# EAGLE design hd-gs (EAGLE 9.6.2)
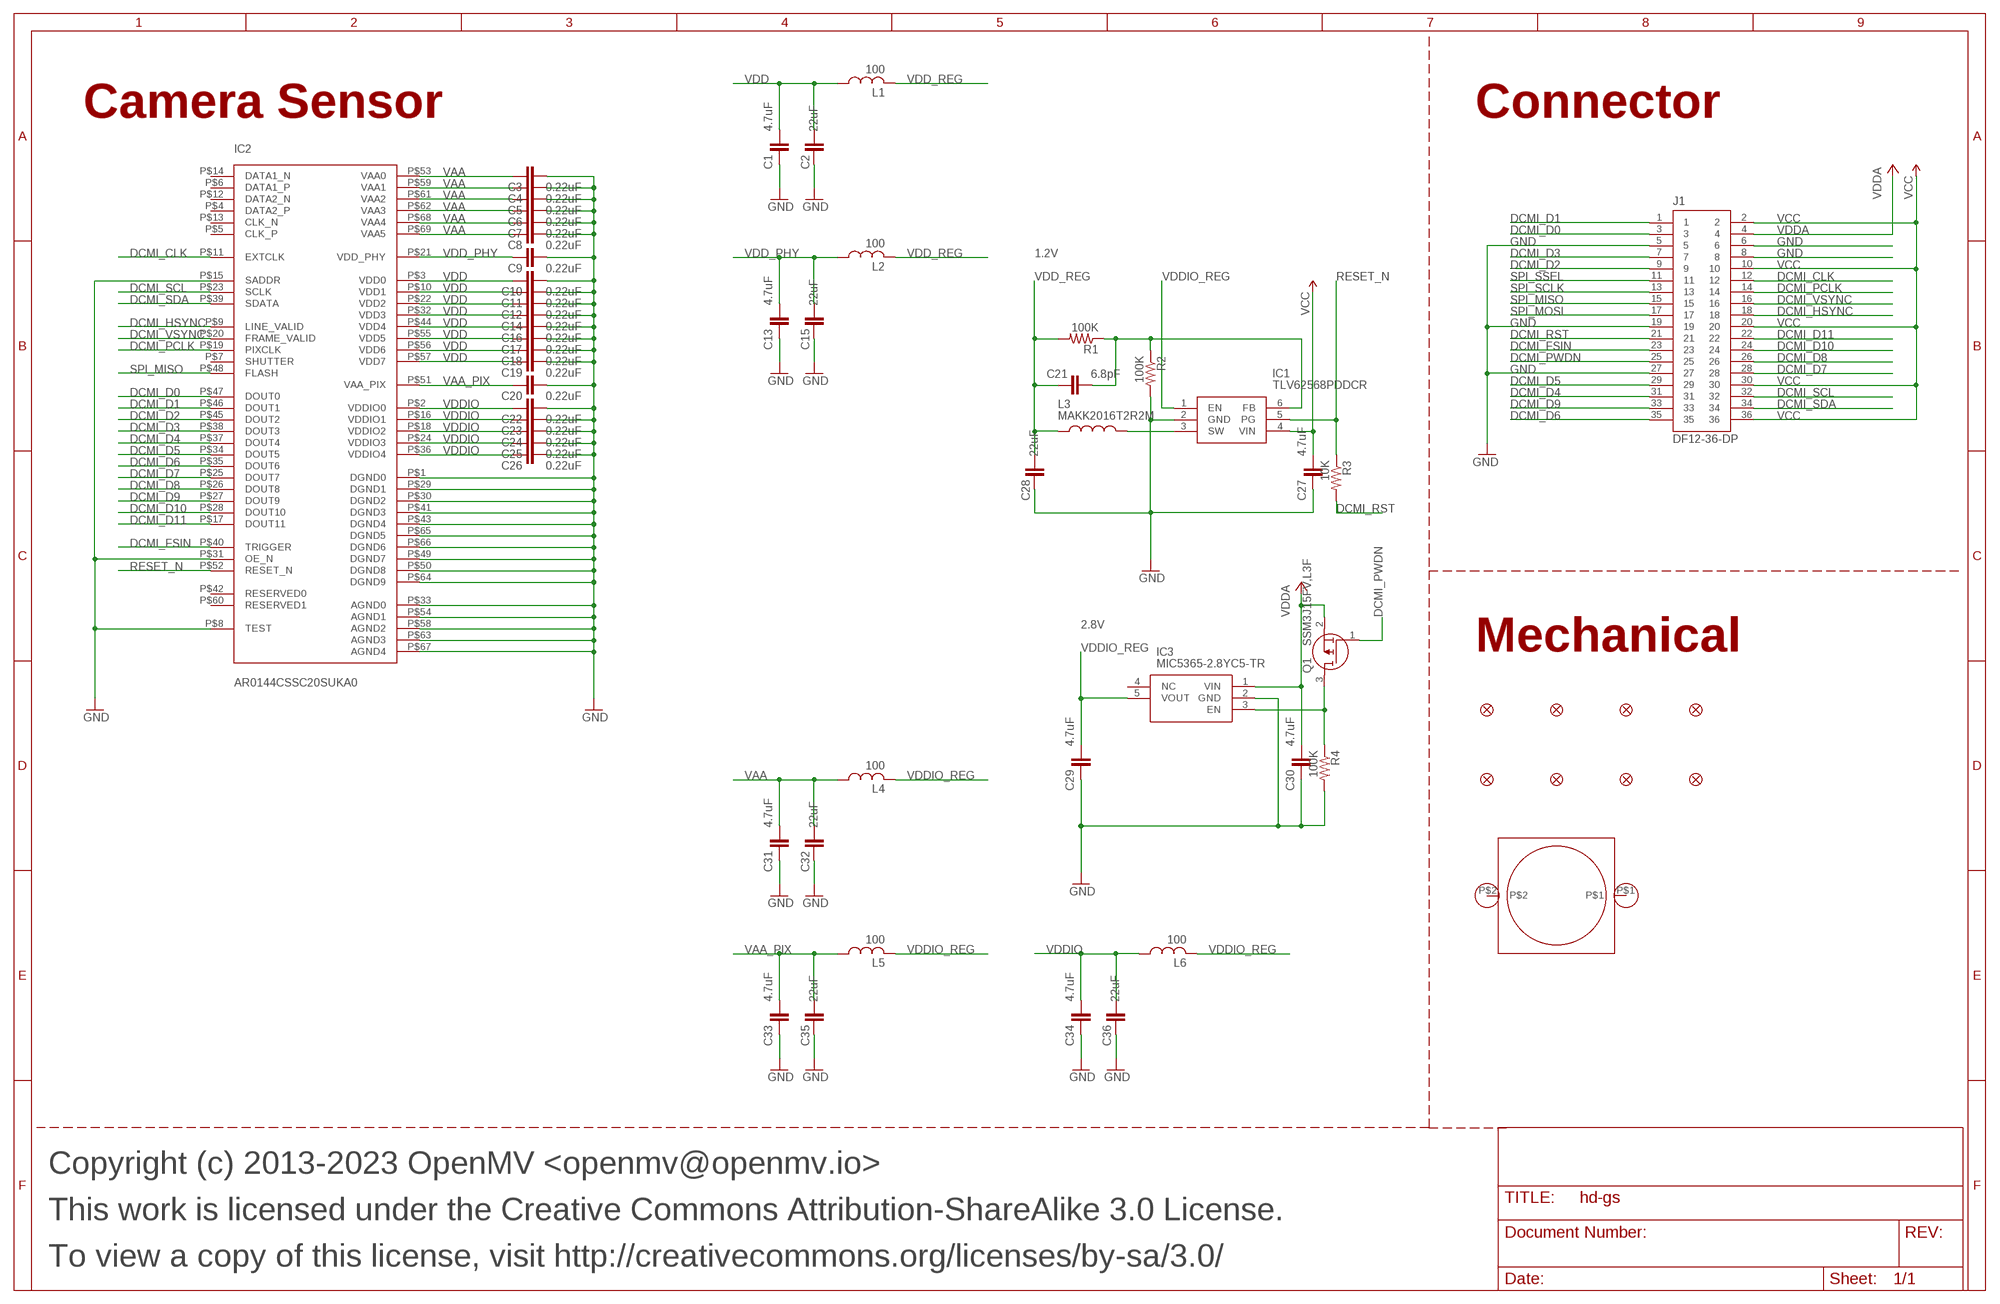
[diagram p0: schematic, sheet 1]

## Parts
C1  4.7uF  CAP_0402  [0402]
C2  22uF  22UF-0805-6.3V-20%  [0805]
C3  0.22uF  C-EUC0201  [C0201]
C4  0.22uF  C-EUC0201  [C0201]
C5  0.22uF  C-EUC0201  [C0201]
C6  0.22uF  C-EUC0201  [C0201]
C7  0.22uF  C-EUC0201  [C0201]
C8  0.22uF  C-EUC0201  [C0201]
C9  0.22uF  C-EUC0201  [C0201]
C10  0.22uF  C-EUC0201  [C0201]
C11  0.22uF  C-EUC0201  [C0201]
C12  0.22uF  C-EUC0201  [C0201]
C13  4.7uF  CAP_0402  [0402]
C14  0.22uF  C-EUC0201  [C0201]
C15  22uF  22UF-0805-6.3V-20%  [0805]
C16  0.22uF  C-EUC0201  [C0201]
C17  0.22uF  C-EUC0201  [C0201]
C18  0.22uF  C-EUC0201  [C0201]
C19  0.22uF  C-EUC0201  [C0201]
C20  0.22uF  C-EUC0201  [C0201]
C21  6.8pF  CAP_0402  [0402]
C22  0.22uF  C-EUC0201  [C0201]
C23  0.22uF  C-EUC0201  [C0201]
C24  0.22uF  C-EUC0201  [C0201]
C25  0.22uF  C-EUC0201  [C0201]
C26  0.22uF  C-EUC0201  [C0201]
C27  4.7uF  CAP_0402  [0402]
C28  22uF  22UF-0805-6.3V-20%  [0805]
C29  4.7uF  CAP_0402  [0402]
C30  4.7uF  CAP_0402  [0402]
C31  4.7uF  CAP_0402  [0402]
C32  22uF  22UF-0805-6.3V-20%  [0805]
C33  4.7uF  CAP_0402  [0402]
C34  4.7uF  CAP_0402  [0402]
C35  22uF  22UF-0805-6.3V-20%  [0805]
C36  22uF  22UF-0805-6.3V-20%  [0805]
FD1  FIDUCIAL1X2  [FIDUCIAL-1X2]
FD2  FIDUCIAL1X2  [FIDUCIAL-1X2]
FD3  FIDUCIAL1X2  [FIDUCIAL-1X2]
FD4  FIDUCIAL1X2  [FIDUCIAL-1X2]
FD5  FIDUCIAL1X2  [FIDUCIAL-1X2]
FD6  FIDUCIAL1X2  [FIDUCIAL-1X2]
FD7  FIDUCIAL1X2  [FIDUCIAL-1X2]
FD8  FIDUCIAL1X2  [FIDUCIAL-1X2]
H1  LENSMOUNT20MM  [LENSMOUNT-20MM]
IC1  TLV62568PDDCR  [SOT95P280X110-6N]
IC2  AR0144CSSC20SUKA0  [AR0144CSSC20SUKA0]
IC3  MIC5365-2.8YC5-TR  [SOT65P210X110-5N]
J1  DF12-36-DP  [DF12-36-DP]
L1  100  INDUCTOR_0402  [0402]
L2  100  INDUCTOR_0402  [0402]
L3  MAKK2016T2R2M  [INDC2016X100N]
L4  100  INDUCTOR_0402  [0402]
L5  100  INDUCTOR_0402  [0402]
L6  100  INDUCTOR_0402  [0402]
Q1  SSM3J15FV,L3F  [SSM3J15FVL3F]
R1  100K  R-US_R0402  [R0402]
R2  100K  R-US_R0402  [R0402]
R3  10K  R-US_R0402  [R0402]
R4  100K  R-US_R0402  [R0402]

## Nets
DCMI_CLK [signal]: IC2.P$11(EXTCLK) J1.12
DCMI_D0 [signal]: IC2.P$47(DOUT0) J1.3
DCMI_D1 [signal]: IC2.P$46(DOUT1) J1.1
DCMI_D2 [signal]: IC2.P$45(DOUT2) J1.9
DCMI_D3 [signal]: IC2.P$38(DOUT3) J1.7
DCMI_D4 [signal]: IC2.P$37(DOUT4) J1.31
DCMI_D5 [signal]: IC2.P$34(DOUT5) J1.29
DCMI_D6 [signal]: IC2.P$35(DOUT6) J1.35
DCMI_D7 [signal]: IC2.P$25(DOUT7) J1.28
DCMI_D8 [signal]: IC2.P$26(DOUT8) J1.26
DCMI_D9 [signal]: IC2.P$27(DOUT9) J1.33
DCMI_D10 [signal]: IC2.P$28(DOUT10) J1.24
DCMI_D11 [signal]: IC2.P$17(DOUT11) J1.22
DCMI_FSIN [signal]: IC2.P$40(TRIGGER) J1.23
DCMI_HSYNC [signal]: IC2.P$9(LINE_VALID) J1.18
DCMI_PCLK [signal]: IC2.P$19(PIXCLK) J1.14
DCMI_PWDN [signal]: J1.25 Q1.1(G)
DCMI_PWDN_INT [signal]: IC3.3(EN) Q1.3(D) R4.1
DCMI_RST [signal]: J1.21 R3.2
DCMI_SCL [signal]: IC2.P$23(SCLK) J1.32
DCMI_SDA [signal]: IC2.P$39(SDATA) J1.34
DCMI_VSYNC [signal]: IC2.P$20(FRAME_VALID) J1.16
FB [pwr]: C21.2 IC1.6(FB) R1.1 R2.1
GND [gnd]: C1.1 C2.1 C3.2 C4.2 C5.2 C6.2 C7.2 C8.2 C9.2 C10.2 C11.2 C12.2 C13.1 C14.2 C15.1 C16.2 C17.2 C18.2 C19.2 C20.2 C22.2 C23.2 C24.2 C25.2 C26.2 C27.1 C28.1 C29.1 C30.1 C31.1 C32.1 C33.1 C34.1 C35.1 C36.1 IC1.2(GND) IC2.P$1(DGND0) IC2.P$8(TEST) IC2.P$15(SADDR) IC2.P$29(DGND1) IC2.P$30(DGND2) IC2.P$31(OE_N) IC2.P$33(AGND0) IC2.P$41(DGND3) IC2.P$43(DGND4) IC2.P$49(DGND7) IC2.P$50(DGND8) IC2.P$54(AGND1) IC2.P$58(AGND2) IC2.P$63(AGND3) IC2.P$64(DGND9) IC2.P$65(DGND5) IC2.P$66(DGND6) IC2.P$67(AGND4) IC3.2(GND) J1.5 J1.6 J1.8 J1.19 J1.27 R2.2 R4.2
RESET_N [signal]: IC1.5(PG) IC2.P$52(RESET_N) R3.1
SPI_MISO [signal]: IC2.P$48(FLASH) J1.15
SPI_MOSI [signal]: J1.17
SPI_SCLK [signal]: J1.13
SPI_SSEL [signal]: J1.11
SW [pwr]: IC1.3(SW) L3.2
VAA [pwr]: C3.1 C4.1 C5.1 C6.1 C7.1 C8.1 C31.2 C32.2 IC2.P$53(VAA0) IC2.P$59(VAA1) IC2.P$61(VAA2) IC2.P$62(VAA3) IC2.P$68(VAA4) IC2.P$69(VAA5) L4.1
VAA_PIX [pwr]: C20.1 C33.2 C35.2 IC2.P$51(VAA_PIX) L5.1
VCC [pwr]: C27.2 IC1.4(VIN) J1.2 J1.10 J1.20 J1.30 J1.36
VDD [pwr]: C1.2 C2.2 C10.1 C11.1 C12.1 C14.1 C16.1 C17.1 C18.1 C19.1 IC2.P$3(VDD0) IC2.P$10(VDD1) IC2.P$22(VDD2) IC2.P$32(VDD3) IC2.P$44(VDD4) IC2.P$55(VDD5) IC2.P$56(VDD6) IC2.P$57(VDD7) L1.1
VDD_PHY [pwr]: C9.1 C13.2 C15.2 IC2.P$21(VDD_PHY) L2.1
VDD_REG [pwr]: C21.1 C28.2 L1.2 L2.2 L3.1 R1.2
VDDA [pwr]: C30.2 IC3.1(VIN) J1.4 Q1.2(S)
VDDIO [pwr]: C22.1 C23.1 C24.1 C25.1 C26.1 C34.2 C36.2 IC2.P$2(VDDIO0) IC2.P$16(VDDIO1) IC2.P$18(VDDIO2) IC2.P$24(VDDIO3) IC2.P$36(VDDIO4) L6.1
VDDIO_REG [pwr]: C29.2 IC1.1(EN) IC3.5(VOUT) L4.2 L5.2 L6.2
Unconnected: H1.P$1 H1.P$2 IC2.P$4(DATA2_P) IC2.P$5(CLK_P) IC2.P$6(DATA1_P) IC2.P$7(SHUTTER) IC2.P$12(DATA2_N) IC2.P$13(CLK_N) IC2.P$14(DATA1_N) IC2.P$42(RESERVED0) IC2.P$60(RESERVED1) IC3.4(NC)

## Notes on the sheet
- Camera Sensor | Connector
- 1.2V
- 2.8V
- Mechanical
- Copyright (c) 2013-2023 OpenMV <openmv@openmv.io>
- This work is licensed under the Creative Commons Attribution-ShareAlike 3.0 License.
- To view a copy of this license, visit http://creativecommons.org/licenses/by-sa/3.0/

## Library data of the parts
C1 C13 C27 C29-C31 C33 C34 = 0402:CAP_0402: 0402 (1005 Metric) Nick Garner - TeleSense; MPN: JMK105BBJ475MV-F
C2 C15 C28 C32 C35 C36 = SparkFun-Capacitors:22UF: 22µF ceramic capacitors A capacitor is a passive two-terminal electrical component used to store electrical energy temporarily in an electric field.; MPN: CL21A226MQQNNNE; PROD_ID: CAP-08402
C3-C12 C14 C16-C20 C22-C26 = rcl:C-EU: CAPACITOR, European symbol; MPN: GRM033R60J224ME15D; SPICEPREFIX: C
C21 = 0402:CAP_0402: 0402 (1005 Metric) Nick Garner - TeleSense; MPN: GRM1555C1H6R8DA01D
FD1-FD8 = SparkFun-Aesthetics:FIDUCIAL: Fiducial Alignment Points Point-of-reference for pick-and-place machines and other optical instruments.
H1 = lensmount:LENSMOUNT
IC1 = TLV62568PDDCR:TLV62568PDDCR: 2.5V-5.5V input, 1A high efficiency step-down buck converter in SOT23 and SOT563 package Source: Datasheet <http://www.ti.com/lit/gpn/tlv62568>; DESCRIPTION: 2.5V-5.5V input, 1A high efficiency step-down buck converter in SOT23 and SOT563 package; HEIGHT: 1.1mm; MANUFACTURER_NAME: Texas Instruments; MANUFACTURER_PART_NUMBER: TLV62568PDDCR; MOUSER_PART_NUMBER: 595-TLV62568PDDCR; MOUSER_PRICE-STOCK: https://www.mouser.co.uk/ProductDetail/Texas-Instruments/TLV62568PDDCR?qs=1mbolxNpo8f1FPchIXcxyQ%3D%3D; MPN: TLV62568PDDCR
IC2 = AR0144CSSC20SUKA0:AR0144CSSC20SUKA0; MPN: AR0144CSSC20SUKA0-CRBR
IC3 = MIC5365-2.8YC5-TR:MIC5365-2.8YC5-TR: IC REG LINEAR 2.8V 150MA SC70-5 Source: Datasheet <http://www.microchip.com/mymicrochip/filehandler.aspx?ddocname=en580022>; DESCRIPTION: IC REG LINEAR 2.8V 150MA SC70-5; HEIGHT: 1.1mm; MANUFACTURER_NAME: Microchip; MANUFACTURER_PART_NUMBER: MIC5365-2.8YC5-TR; MOUSER_PART_NUMBER: 998-MIC5365-2.8YC5TR; MOUSER_PRICE-STOCK: https://www.mouser.co.uk/ProductDetail/Microchip-Technology-Atmel/MIC5365-2.8YC5-TR?qs=U6T8BxXiZAX3mJDSWJyjVA%3D%3D; MPN: MIC5365-2.8YC5-TR
J1 = DF12NB(3.0)-36DP-0.5V(51):DF12-36-DP; MPN: DF12NB(3.0)-36DP-0.5V(51)
L1 L2 L4-L6 = 0402:INDUCTOR_0402; MPN: MFBM1V1005-101-R
L3 = MAKK2016T2R2M:MAKK2016T2R2M: INDUCTOR, METAL CORE Check availability <https://pricing.snapeda.com/parts/MAKK2016T2R2M/Taiyo%20Yuden/view-part?ref=eda>; AVAILABILITY: In Stock; DESCRIPTION: 2.2 µH Shielded Drum Core, Wirewound Inductor 1.5 A 160mOhm Max 0806 (2016 Metric); MF: Taiyo Yuden; MP: MAKK2016T2R2M; MPN: MAKK2016T2R2M; PACKAGE: 2016 Taiyo Yuden; PRICE: None; PURCHASE-URL: https://pricing.snapeda.com/search/part/MAKK2016T2R2M/?ref=eda
Q1 = SSM3J15FV_L3F:SSM3J15FV,L3F: MOSFET Small-signal MOSFET High Speed Switching Source: Datasheet <https://toshiba.semicon-storage.com/info/docget.jsp?did=593&prodName=SSM3J15FV>; DESCRIPTION: MOSFET Small-signal MOSFET High Speed Switching; HEIGHT: 0.55mm; MANUFACTURER_NAME: Toshiba; MANUFACTURER_PART_NUMBER: SSM3J15FV,L3F; MOUSER_PART_NUMBER: 757-SSM3J15FVL3F; MOUSER_PRICE-STOCK: https://www.mouser.co.uk/ProductDetail/Toshiba/SSM3J15FVL3F?qs=PDgMCp4xDJb4qTgE7FAUzA%3D%3D; MPN: SSM3J15FV,L3F
R1 R2 R4 = rcl:R-US_: RESISTOR, American symbol; MPN: AC0402FR-07100KL; SPICEPREFIX: R
R3 = rcl:R-US_: RESISTOR, American symbol; MPN: AC0402FR-1310KL; SPICEPREFIX: R

## Net classes
0 default: width 0.076 mm, drill 0.102 mm, clearance 0.076 mm
2 gnd: width 0.076 mm, drill 0.102 mm, clearance 0.076 mm to class 0, clearance 0.076 mm to class 1, clearance 0.127 mm
3 pwr: width 0.076 mm, drill 0.102 mm, clearance 0.076 mm to class 0, clearance 0.076 mm to class 1, clearance 0.076 mm to class 2, clearance 0.127 mm
4 signal: width 0.076 mm, drill 0.102 mm, clearance 0.076 mm to class 0, clearance 0.076 mm to class 1, clearance 0.076 mm to class 2, clearance 0.076 mm to class 3, clearance 0.127 mm

## Board
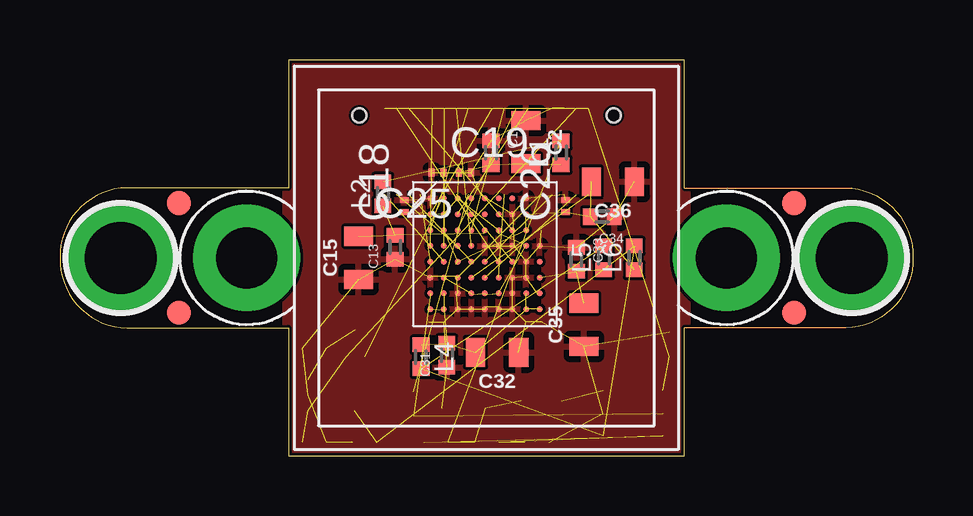
[diagram p1: board, top side]
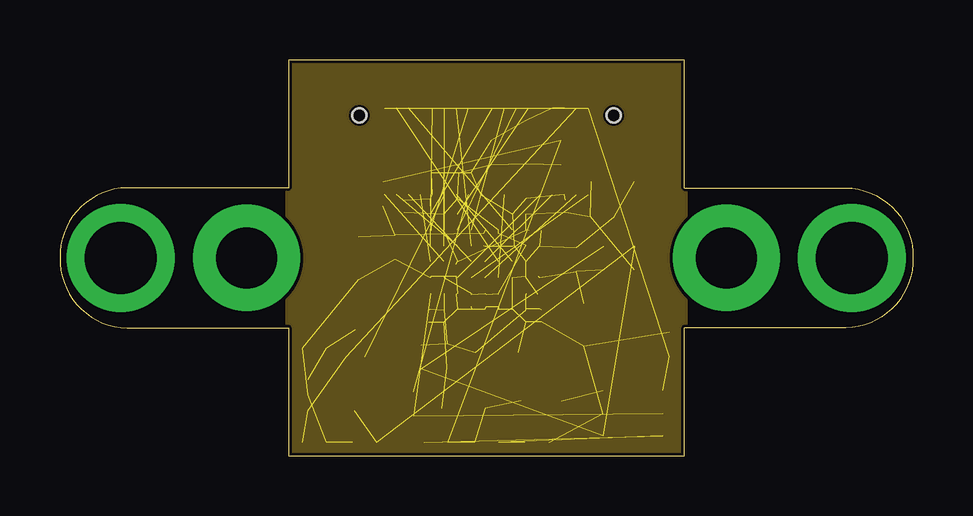
[diagram p2: board, inner layer GND]
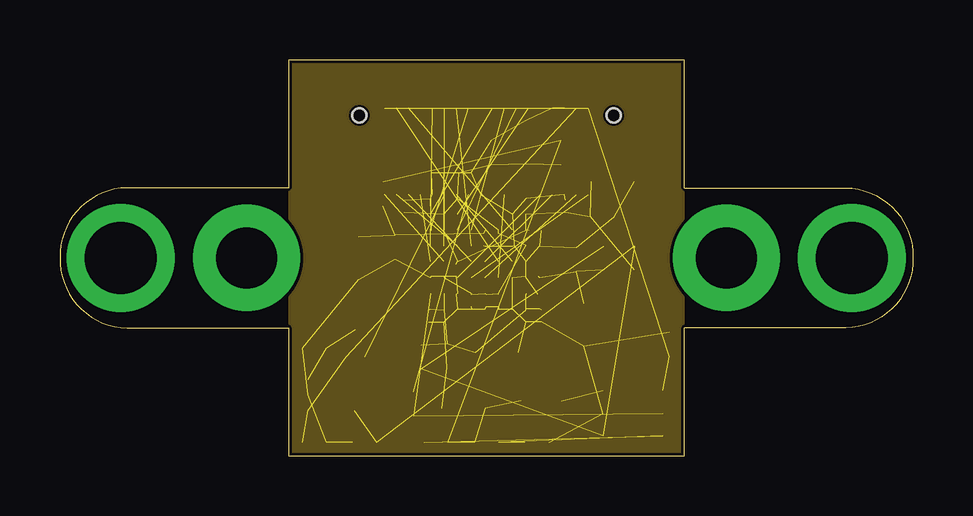
[diagram p3: board, inner layer VCC]
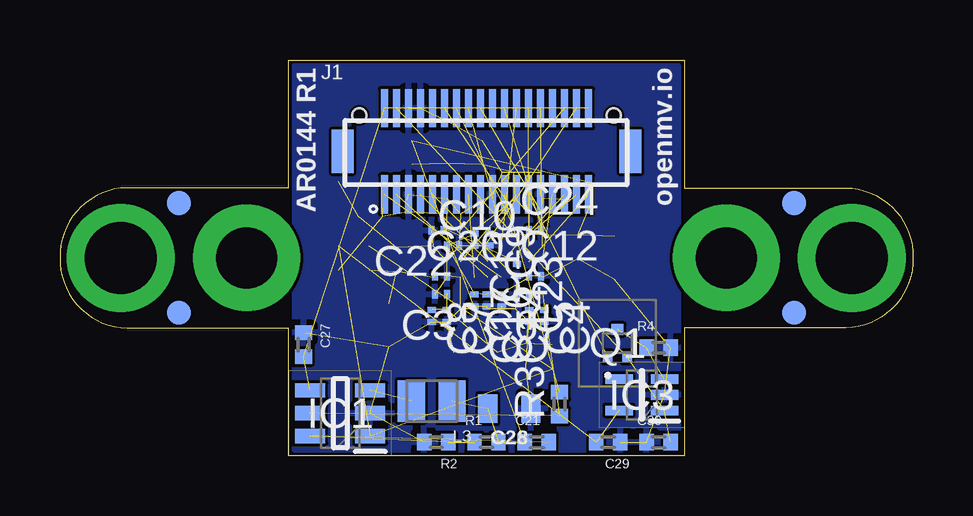
[diagram p4: board, bottom side, seen from below]

Size 35.56 x 16.51 mm. Coordinates in mm from the lower left corner, seen from the top.
Outline: 9.53,16.51 9.53,11.18 2.79,11.18 arc90 0,8.26 arc90 2.79,5.33 9.53,5.33 9.53,0 26.04,0 26.04,5.33 32.77,5.33 arc90 35.56,8.26 arc90 32.77,11.18 26.04,11.18 26.04,16.51 9.53,16.51
Copper layers (1*2*3*14*15*16): Top 0.035mm / dielectric 0.23mm / GND 0.035mm / dielectric 0.38mm / Route3 0.035mm / dielectric 0.15mm / Route14 0.035mm / dielectric 0.38mm / VCC 0.035mm / dielectric 0.23mm / Bottom 0.035mm
Design rules "MF_Ext_4_mil_drill_6_Layer": minimum track width 3mil, minimum drill 4mil, track to track 3mil, track to pad 3mil, pad to pad 3mil, via to via 3mil, smd to smd 0mil, copper to edge 3mil, drill to drill 3mil, minimum pad ring 3mil, minimum via ring 3mil, stop-mask expansion 2mil, vias tented up to drill 25mil, thermal gap 10mil
tKeepout: area 9.5,15.3 to 26,16.5; area 9.5,0 to 10.7,16.5; area 9.5,0 to 26,1.2; area 24.8,0 to 26,16.5

### Footprints (pad centres in the part's own frame; a part is rotated, then mirrored left to right if it is on the bottom)
0402 = smd 0.6 x 0.7: 1 -0.5,0; 2 0.5,0
0805 = smd 0.8 x 1.2: 1 -0.9,0; 2 0.9,0
C0201 = smd 0.25 x 0.35: 1 -0.25,0; 2 0.25,0
FIDUCIAL-1X2 = smd 1 x 1: 1 0,0
LENSMOUNT-20MM = drill 2.54 pad 4.445: P$1 -10,0; P$2 10,0
SOT95P280X110-6N = smd 1.25 x 0.6: 1 -1.25,0.95; 2 -1.25,0; 3 -1.25,-0.95; 4 1.25,-0.95; 5 1.25,0; 6 1.25,0.95
AR0144CSSC20SUKA0 = smd 0.25 x 0.25: P$1 -2.28,2.31; P$2 -1.71,2.31; P$3 -1.14,2.31; P$4 -0.57,2.31; P$5 0,2.31; P$6 0.57,2.31; P$7 1.14,2.31; P$8 1.71,2.31; P$9 -2.28,1.65; P$10 -1.71,1.65; P$11 -1.14,1.65; P$12 -0.57,1.65; P$13 0,1.65; P$14 0.57,1.65; P$15 1.14,1.65; P$16 1.71,1.65; P$17 -2.28,0.99; P$18 -1.71,0.99; P$19 -1.14,0.99; P$20 -0.57,0.99; P$21 0,0.99; P$22 0.57,0.99; P$23 1.14,0.99; P$24 1.71,0.99; P$25 -2.28,0.33; P$26 -1.71,0.33; P$27 -1.14,0.33; P$28 -0.57,0.33; P$29 0,0.33; P$30 0.57,0.33; P$31 1.14,0.33; P$32 1.71,0.33; P$33 2.28,0.33; P$34 -2.28,-0.33; P$35 -1.71,-0.33; P$36 -1.14,-0.33; P$37 -0.57,-0.33; P$38 0,-0.33; P$39 0.57,-0.33; P$40 1.14,-0.33; P$41 1.71,-0.33; P$42 2.28,-0.33; P$43 -2.28,-0.99; P$44 -1.71,-0.99; P$45 -1.14,-0.99; P$46 -0.57,-0.99; P$47 0,-0.99; P$48 0.57,-0.99; P$49 1.14,-0.99; P$50 1.71,-0.99; P$51 2.28,-0.99; P$52 -2.28,-1.65; P$53 -1.71,-1.65; P$54 -1.14,-1.65; P$55 -0.57,-1.65; P$56 0,-1.65; P$57 0.57,-1.65; P$58 1.14,-1.65; P$59 1.71,-1.65; P$60 2.28,-1.65; P$61 -2.28,-2.31; P$62 -1.71,-2.31; P$63 -1.14,-2.31; P$64 -0.57,-2.31; P$65 0,-2.31; P$66 0.57,-2.31; P$67 1.14,-2.31; P$68 1.71,-2.31; P$69 2.28,-2.31
SOT65P210X110-5N = smd 1.15 x 0.4: 1 -0.95,0.65; 2 -0.95,0; 3 -0.95,-0.65; 4 0.95,-0.65; 5 0.95,0.65
DF12-36-DP = smd 0.3 x 1.6: 1 -4.25,-1.8; 2 -4.25,1.8; 3 -3.75,-1.8; 4 -3.75,1.8; 5 -3.25,-1.8; 6 -3.25,1.8; 7 -2.75,-1.8; 8 -2.75,1.8; 9 -2.25,-1.8; 10 -2.25,1.8; 11 -1.75,-1.8; 12 -1.75,1.8; 13 -1.25,-1.8; 14 -1.25,1.8; 15 -0.75,-1.8; 16 -0.75,1.8; 17 -0.25,-1.8; 18 -0.25,1.8; 19 0.25,-1.8; 20 0.25,1.8; 21 0.75,-1.8; 22 0.75,1.8; 23 1.25,-1.8; 24 1.25,1.8; 25 1.75,-1.8; 26 1.75,1.8; 27 2.25,-1.8; 28 2.25,1.8; 29 2.75,-1.8; 30 2.75,1.8; 31 3.25,-1.8; 32 3.25,1.8; 33 3.75,-1.8; 34 3.75,1.8; 35 4.25,-1.8; 36 4.25,1.8 | smd 0.9 x 1.8: F1 -6,0; F2 6,0 | hole 0.6: -5.3,1.5; 5.3,1.5
INDC2016X100N = smd 1.14 x 1.73: 1 -0.847,0; 2 0.847,0
SSM3J15FVL3F = smd 0.4 x 0.45: 1 -0.4,-0.575; 2 0.4,-0.575 | smd 0.5 x 0.45: 3 0,0.575
R0402 = smd 0.6 x 0.7: 1 -0.5,0; 2 0.5,0

### Placement (x,y rotation side)
C1  17.97,12.64 270 top
C2  19.43,13.08 270 top
C3  19.68,6.73 180 bottom
C4  15.37,5.84 270 bottom
C5  16,5.84 270 bottom
C6  16.26,6.73 180 bottom
C7  19.43,5.84 270 bottom
C8  20.07,5.84 270 bottom
C9  17.65,9.02 270 bottom
C10  19.18,8.76 0 bottom
C11  18.29,9.02 270 bottom
C12  15.75,7.49 0 bottom
C13  13.97,8.7 90 top
C14  17.14,6.48 270 bottom
C15  12.45,8.26 90 top
C16  17.78,6.48 270 bottom
C17  18.29,6.48 270 bottom
C18  14.35,10.41 90 top
C19  16.89,11.81 0 top
C20  19.68,7.49 0 bottom
C21  15.68,0.57 0 bottom
C22  19.81,9.4 180 bottom
C23  16.51,7.75 270 bottom
C24  15.75,9.4 0 bottom
C25  15.75,11.81 180 top
C26  21.08,10.41 90 top
C27  25.4,4.64 270 bottom
C28  16.83,1.97 180 bottom
C29  12.7,0.57 180 bottom
C30  10.6,0.57 0 bottom
C31  16.13,4.19 90 top
C32  18.22,4.32 180 top
C33  21.53,8.19 270 top
C34  22.61,9.97 180 top
C35  21.84,5.46 90 top
C36  23.05,11.43 180 top
FD1  30.61,5.97 0 top
FD2  30.61,10.54 0 top
FD3  30.61,10.54 0 bottom
FD4  30.61,5.97 0 bottom
FD5  4.95,5.97 0 top
FD6  4.95,10.54 0 top
FD7  4.95,10.54 0 bottom
FD8  4.95,5.97 0 bottom
H1  17.78,8.26 0 top
IC1  23.88,1.78 180 bottom
IC2  17.72,8.43 0 top
IC3  11.3,2.54 180 bottom
J1  17.78,12.7 0 bottom
L1  20.89,12.64 90 top
L2  13.46,10.92 90 top
L3  20.07,2.29 180 bottom
L4  15.05,4.13 270 top
L5  22.67,8.26 90 top
L6  23.94,8.26 90 top
Q1  12.32,4.7 0 bottom
R1  17.78,0.57 0 bottom
R2  19.88,0.57 180 bottom
R3  14.73,2.16 90 bottom
R4  10.6,4.51 0 bottom

### Tracks (layer width: path | path; a pad name or v marks a point on that pad's centre or on a via)
DCMI_CLK  (1 unrouted)
DCMI_D0  (1 unrouted)
DCMI_D1  (1 unrouted)
DCMI_D2  (1 unrouted)
DCMI_D3  (1 unrouted)
  Bottom 0.152: J1.7 20.57,10.86
DCMI_D4  (1 unrouted)
DCMI_D5  (1 unrouted)
DCMI_D6  (1 unrouted)
DCMI_D7  (1 unrouted)
DCMI_D8  (1 unrouted)
DCMI_D9  (1 unrouted)
DCMI_D10  (1 unrouted)
DCMI_D11  (1 unrouted)
DCMI_FSIN  (1 unrouted)
DCMI_HSYNC  (1 unrouted)
DCMI_PCLK  (1 unrouted)
DCMI_PWDN  (1 unrouted)
DCMI_PWDN_INT  (2 unrouted)
DCMI_RST  (1 unrouted)
DCMI_SCL  (1 unrouted)
DCMI_SDA  (1 unrouted)
DCMI_VSYNC  (1 unrouted)
FB  (3 unrouted)
GND  (61 unrouted)
  pour GND (isolate 0.127): 9.53,0 9.53,16.51 26.04,16.51 26.04,0
  pour Top (isolate 0.127): 9.4,-0.13 9.4,16.64 26.16,16.64 26.16,-0.13
  pour Bottom (isolate 0.127): 9.78,0.25 9.78,16.26 25.78,16.26 25.78,0.25
N$3  (via drill 3 pad 4.5)
  other vias: 2.54,8.26
N$4  (via drill 3 pad 4.5)
  other vias: 33.02,8.26
RESET_N  (2 unrouted)
SPI_MISO  (1 unrouted)
SW  (1 unrouted)
VAA  (14 unrouted)
VAA_PIX  (4 unrouted)
VCC  (6 unrouted)
  Bottom 0.254: J1.20
  pour VCC (isolate 0.127): 9.65,0.13 9.65,16.38 25.91,16.38 25.91,0.13
VDD  (18 unrouted)
VDD_PHY  (4 unrouted)
VDD_REG  (5 unrouted)
VDDA  (3 unrouted)
VDDIO  (12 unrouted)
VDDIO_REG  (5 unrouted)

### Text on the board
bPlace: openmv.io | AR0144 R1